# Altium schematic sheet BEESP_CODE_io.SchDoc
size A4
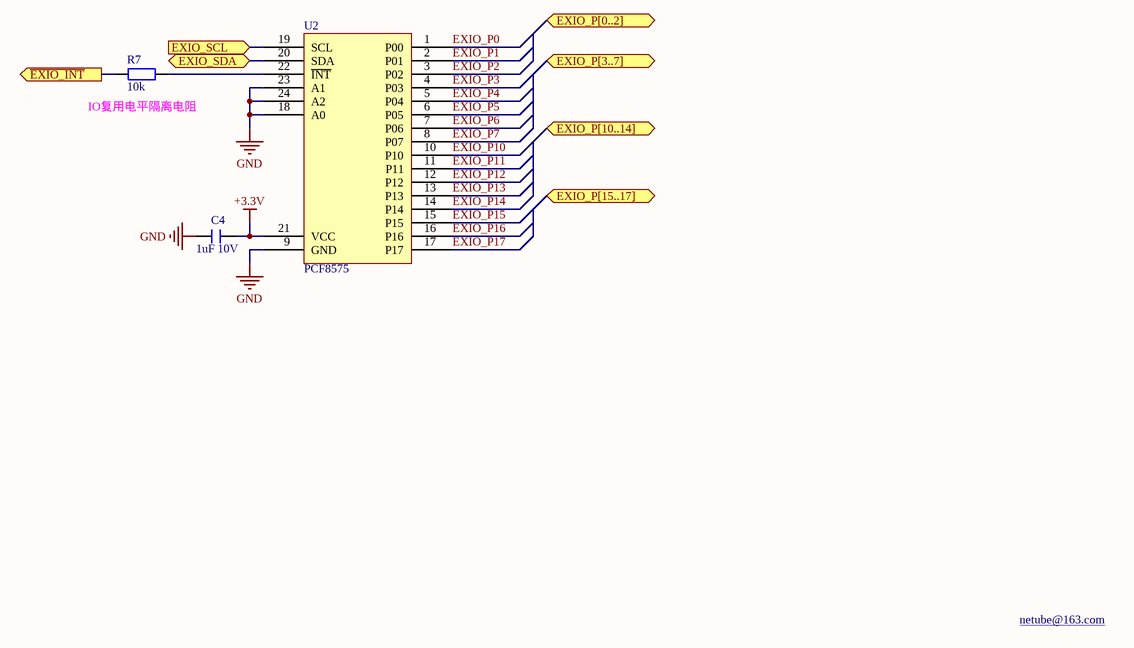
[diagram p0: BEESP_CODE_io.SchDoc]

## Parts
C4  1uF 10V  [C 0402_L]
R7  10k  [R 0402_L]
U2  PCF8575  [QFN24 4x4_N]

## Ports
EXIO_P[0..2] (bidir), EXIO_P[3..7] (bidir), EXIO_P[10..14] (bidir), EXIO_P[15..17] (bidir), EXIO_SCL (in), EXIO_SDA (bidir), ~{EXIO_INT} (out)

## Nets
+3.3V: C4.2 U2.21(VCC)
GND: C4.1 U2.9(GND) U2.18(A0) U2.23(A1) U2.24(A2)
~{EXIO_INT}: R7.2 ; port ~{EXIO_INT}
EXIO_P0: U2.1(P00)
EXIO_P1: U2.2(P01)
EXIO_P2: U2.3(P02)
EXIO_P3: U2.4(P03)
EXIO_P4: U2.5(P04)
EXIO_P5: U2.6(P05)
EXIO_P6: U2.7(P06)
EXIO_P7: U2.8(P07)
EXIO_P10: U2.10(P10)
EXIO_P11: U2.11(P11)
EXIO_P12: U2.12(P12)
EXIO_P13: U2.13(P13)
EXIO_P14: U2.14(P14)
EXIO_P15: U2.15(P15)
EXIO_P16: U2.16(P16)
EXIO_P17: U2.17(P17)
EXIO_SCL: U2.19(SCL) ; port EXIO_SCL
EXIO_SDA: U2.20(SDA) ; port EXIO_SDA
NetR7_1: R7.1 U2.22(~{INT})

## Notes on the sheet
- (near R7) IO复用电平隔离电阻
- netube@163.com

## Library data of the parts
C4 = C: 贴片电容; BOM名称: 无极性贴片电容; 优秀评价可免费更新: 联系淘宝ID：黄晶宝石，获取更新版封装库; 卖家免费技术支持，联系售后: 唯一出售店铺网址https://shop463601444.taobao.com; 本封装库来自淘宝卖家 ID：黄晶宝石: 其他店铺购入均为盗版，请立即申请退款
R7 = R: 贴片电阻; 优秀评价可免费更新: 联系淘宝ID：黄晶宝石，获取更新版封装库; 卖家免费技术支持，联系售后: 唯一出售店铺网址https://shop463601444.taobao.com; 本封装库来自淘宝卖家 ID：黄晶宝石: 其他店铺购入均为盗版，请立即申请退款; BOM名称: 贴片电阻